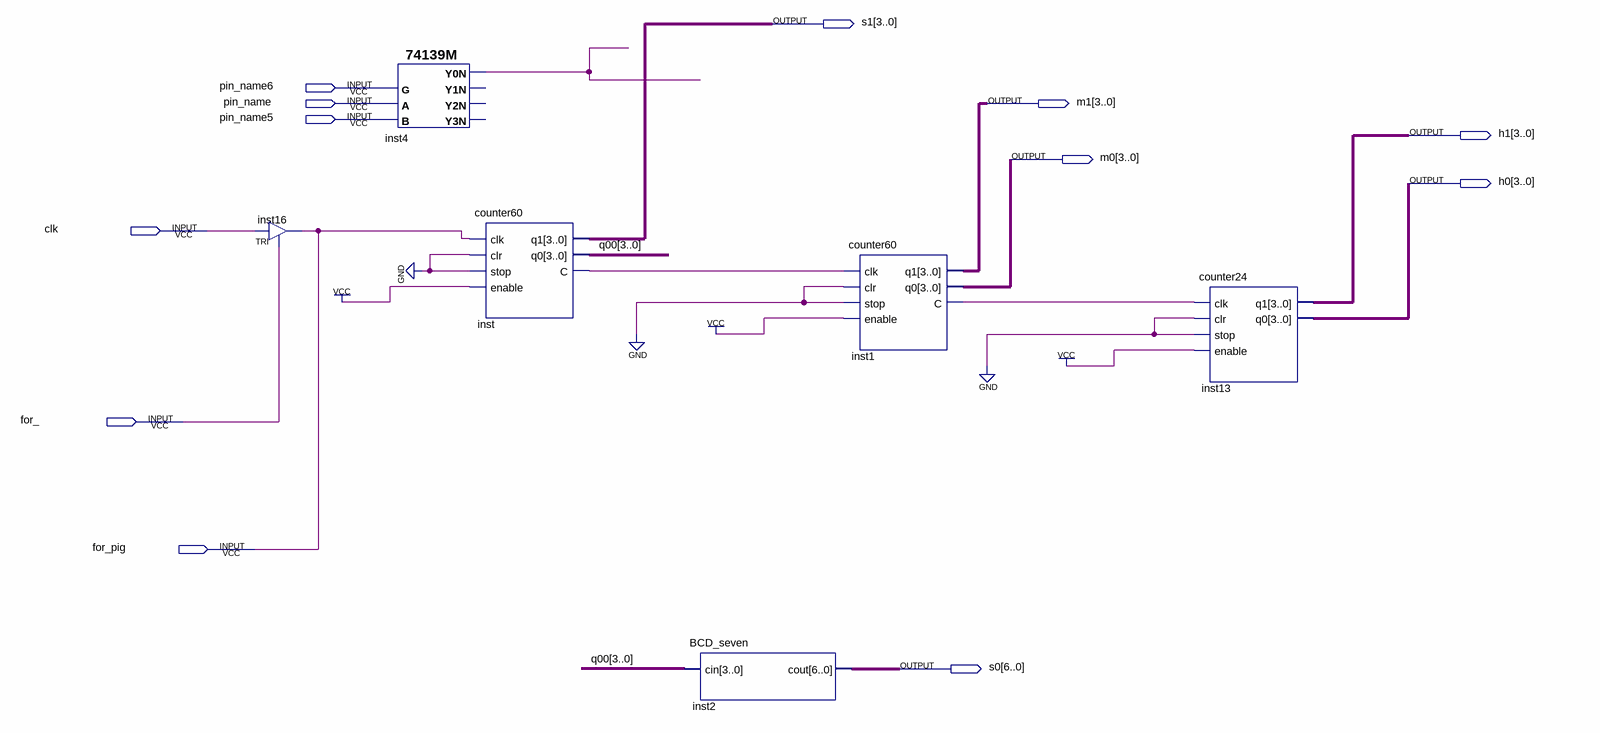
[diagram p0: schematic sheet]
// Quartus schematic jicheng.bdf as structural Verilog: 6 symbols, 12 pins
module jicheng (
  input  pin_name6,
  input  pin_name,
  input  pin_name5,
  input  clk,
  input  for_,
  input  for_pig,
  output [3:0] s1,
  output [3:0] m1,
  output [3:0] h1,
  output [3:0] m0,
  output [3:0] h0,
  output [6:0] s0
);

  wire inst1_c, inst4_y0n, inst_c;
  wire [3:0] q00;

  TRI inst16 (.IN(clk), .OE(for_), .OUT(for_pig));
  \74139M  inst4 (.B(pin_name5), .A(pin_name), .G(pin_name6), .Y0N(inst4_y0n));  // open: Y3N, Y2N, Y1N
  counter60 inst (.clk(for_pig), .clr(1'b0), .stop(1'b0), .enable(1'b1), .C(inst_c), .q1(s1), .q0(q00));
  BCD_seven inst2 (.cin(q00), .cout(s0));
  counter60 inst1 (.clk(inst_c), .clr(1'b0), .stop(1'b0), .enable(1'b1), .C(inst1_c), .q1(m1), .q0(m0));
  counter24 inst13 (.clk(inst1_c), .clr(1'b0), .stop(1'b0), .enable(1'b1), .q1(h1), .q0(h0));
endmodule
